# Altium schematic sheet 原理图文件.SchDoc
size A3; PageSetup: Record=PageOptions|CenterHorizontal=True|CenterVertical=True|PrintScale=0.89|XCorrection=1.00|YCorrection=1.00|PrintKind=1|BorderSize=5000000|LeftOffset=0|BottomOffset=0|Orientation=2|PaperLength=1000|PaperWidth=1000|Scale=100|PaperSource=15|PrintQuality=600|MediaType=1|DitherType=10|PaperKind=信纸¦PrintScaleMode=1
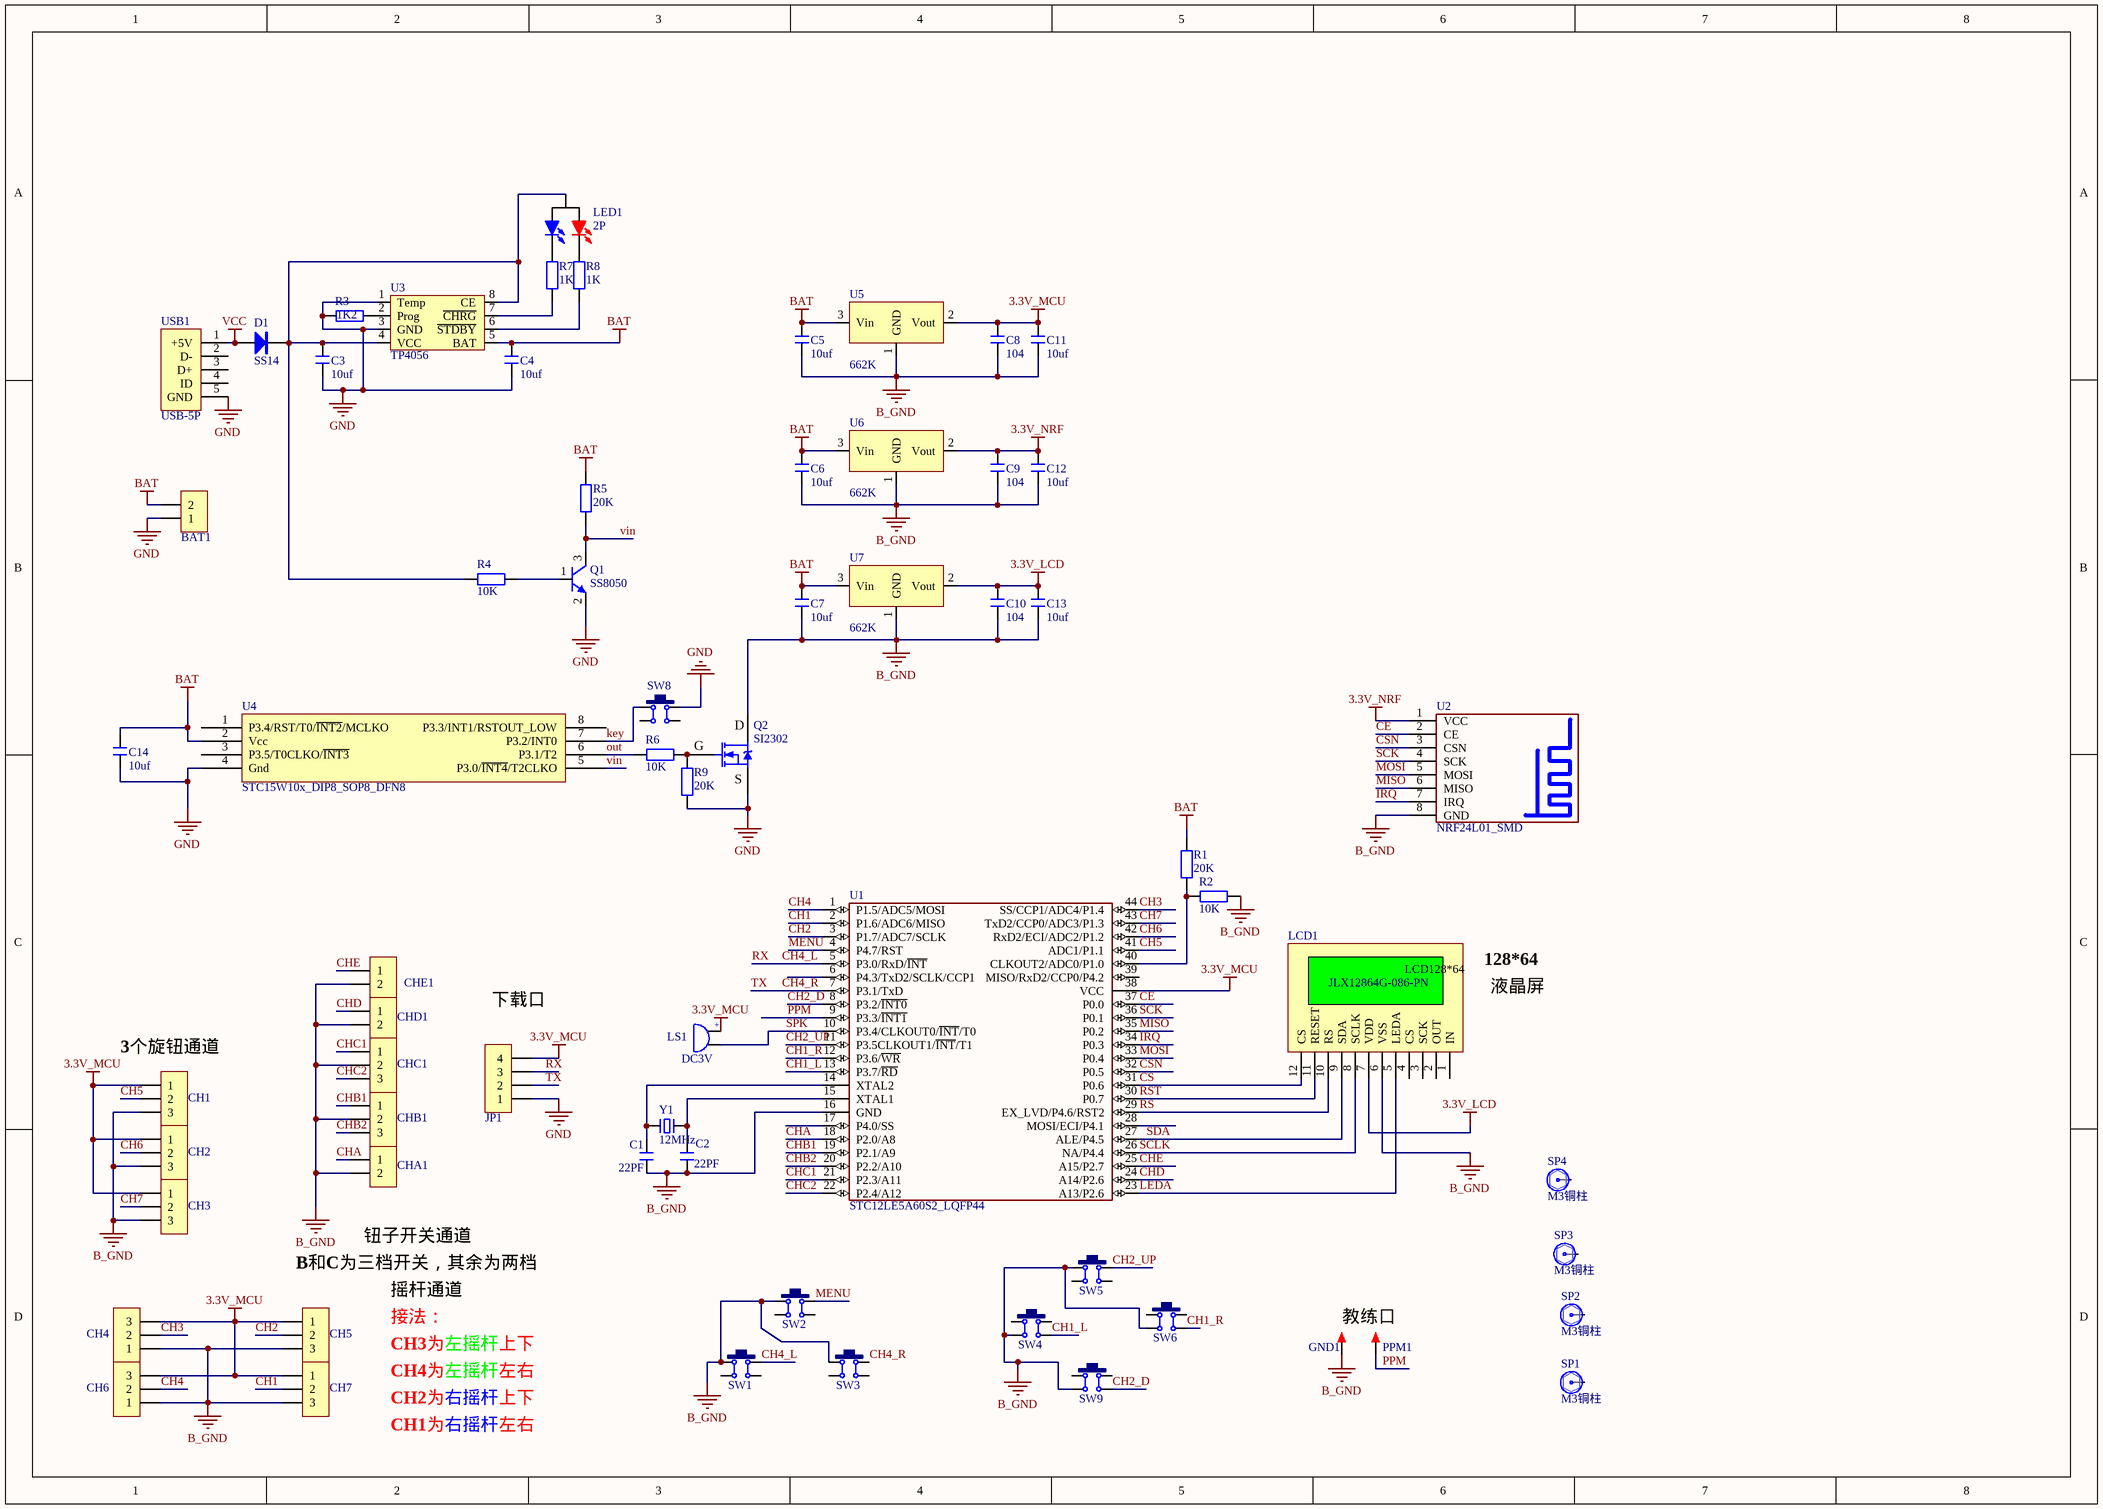
[diagram p0: 原理图文件.SchDoc]

## Parts
BAT1  HDR-1X2  [XH2.54-LI-2P]  (value not drawn)
C1  22PF  [C 0805_L]
C2  22PF  [C 0805_L]
C3  10uf  [C 0805_L]
C4  10uf  [C 0805_L]
C5  10uf  [C 0805_L]
C6  10uf  [C 0805_L]
C7  10uf  [C 0805_L]
C8  104  [C 0805_L]
C9  104  [C 0805_L]
C10  104  [C 0805_L]
C11  10uf  [C 0805_L]
C12  10uf  [C 0805_L]
C13  10uf  [C 0805_L]
C14  10uf  [C 0805_L]
CH1  CH5  [HDR2.54-LI-3P]  (value not drawn)
CH2  CH6  [HDR2.54-LI-3P]  (value not drawn)
CH3  CH7  [HDR2.54-LI-3P]  (value not drawn)
CH4  CH3  [HDR2.54-LI-3P]  (value not drawn)
CH5  CH2  [HDR2.54-LI-3P]  (value not drawn)
CH6  CH4  [HDR2.54-LI-3P]  (value not drawn)
CH7  CH1  [HDR2.54-LI-3P]  (value not drawn)
CHA1  CHA  [HDR2.54-LI-2P]  (value not drawn)
CHB1  CHB  [HDR2.54-LI-3P]  (value not drawn)
CHC1  CHC  [HDR2.54-LI-3P]  (value not drawn)
CHD1  CHD  [HDR2.54-LI-2P]  (value not drawn)
CHE1  CHE  [HDR2.54-LI-2P]  (value not drawn)
D1  SS14  [SMA]
GND1  TEST  [TEST 1.6]  (value not drawn)
JP1  HDR-1X4  [HDR2.54-LI-4P]  (value not drawn)
LCD1  JLX12864G-086-PN  [JLX12864G-086]
LED1  2P  [LED 3mm-2P]
LS1  DC3V  [BEEP 5x9x5.5]
PPM1  TEST  [TEST 1.6]  (value not drawn)
Q1  SS8050  [SOT23-3N]
Q2  SI2302  [SOT23-3N]
R1  20K  [R 0805_L]
R2  10K  [R 0805_L]
R3  1K2  [R 0805_L]
R4  10K  [R 0805_L]
R5  20K  [R 0805_L]
R6  10K  [R 0805_L]
R7  1K  [R 0805_L]
R8  1K  [R 0805_L]
R9  20K  [R 0805_L]
SP1  M3铜柱  [M3x7_L]
SP2  M3铜柱  [M3x7_L]
SP3  M3铜柱  [M3x7_L]
SP4  M3铜柱  [M3x7_L]
SW1  6x6x5  [TSW DIP-6*6*8]  (value not drawn)
SW2  6x6x5  [TSW DIP-6*6*8]  (value not drawn)
SW3  6x6x5  [TSW DIP-6*6*8]  (value not drawn)
SW4  6x6x5  [TSW DIP-6*6*8]  (value not drawn)
SW5  6x6x5  [TSW DIP-6*6*8]  (value not drawn)
SW6  6x6x5  [TSW DIP-6*6*8]  (value not drawn)
SW8  6x6x5  [TSW DIP-6*6*8]  (value not drawn)
SW9  6x6x5  [TSW DIP-6*6*8]  (value not drawn)
U1  STC12LE5A60S2_LQFP44  [LQFP44 10X10_N]
U2  NRF24L01_SMD  [NRF24l01_4to1]
U3  TP4056  [SOP8_N]
U4  STC15W10x_DIP8_SOP8_DFN8  [SOP8_N]
U5  662K  [SOT23-3L]
U6  662K  [SOT23-3L]
U7  662K  [SOT23-3L]
USB1  USB-5P  [USB-MICRO_D]
Y1  12MHz  [OSC HC-49S]

## Nets
3.3V_LCD: C10.2 C13.2 LCD1.7(VDD) U7.2(Vout)
3.3V_MCU: C8.2 C11.2 CH1.1 CH2.1 CH3.1 CH4.3 CH5.1 CH6.3 CH7.1 JP1.4 LS1.1 U1.38(VCC) U5.2(Vout)
3.3V_NRF: C9.2 C12.2 U2.1(VCC) U6.2(Vout)
B_GND: C1.1 C2.1 C5.1 C6.1 C7.1 C8.1 C9.1 C10.1 C11.1 C12.1 C13.1 CH1.3 CH2.3 CH3.3 CH4.1 CH5.3 CH6.1 CH7.3 CHA1.2 CHB1.2 CHC1.2 CHD1.2 CHE1.2 GND1.1 LCD1.6(VSS) Q2.3(D) R2.1 SW1.1 SW2.1 SW3.2 SW4.4 SW5.1 SW6.3 SW9.4 U1.16(GND) U2.8(GND) U5.1(GND) U6.1(GND) U7.1(GND)
BAT: BAT1.2 C4.2 C5.2 C6.2 C7.2 C14.2 R1.2 R5.2 U3.5(BAT) U4.2(Vcc) U5.3(Vin) U6.3(Vin) U7.3(Vin)
GND: BAT1.1 C3.1 C4.1 C14.1 JP1.1 Q1.2(E) Q2.2(S) R3.1 R9.1 SW8.1 U2.9 U2.10 U2.11 U3.1(Temp) U3.3(GND) U4.4(Gnd) USB1.5(GND)
VCC: D1.1(A) USB1.1(+5V)
CE: U1.37(P0.0) U2.2(CE)
CH1: CH7.2 U1.2(P1.6/ADC6/MISO)
CH1_L: SW4.3 U1.13(P3.7/~{RD})
CH1_R: SW6.4 U1.12(P3.6/~{WR})
CH2: CH5.2 U1.3(P1.7/ADC7/SCLK)
CH2_D: SW9.3 U1.8(P3.2/~{INT0})
CH2_UP: SW5.2 U1.11(P3.5CLKOUT1/~{INT}/T1)
CH3: CH4.2 U1.44(SS/CCP1/ADC4/P1.4)
CH4: CH6.2 U1.1(P1.5/ADC5/MOSI)
CH4_L: JP1.3 SW1.2 U1.5(P3.0/RxD/~{INT})  [also labelled RX]
CH4_R: JP1.2 SW3.1 U1.7(P3.1/TxD)  [also labelled TX]
CH5: CH1.2 U1.41(ADC1/P1.1)
CH6: CH2.2 U1.42(RxD2/ECI/ADC2/P1.2)
CH7: CH3.2 U1.43(TxD2/CCP0/ADC3/P1.3)
CHA: CHA1.1 U1.18(P2.0/A8)
CHB1: CHB1.1 U1.19(P2.1/A9)
CHB2: CHB1.3 U1.20(P2.2/A10)
CHC1: CHC1.1 U1.21(P2.3/A11)
CHC2: CHC1.3 U1.22(P2.4/A12)
CHD: CHD1.1 U1.24(A14/P2.6)
CHE: CHE1.1 U1.25(A15/P2.7)
CS: LCD1.12(CS) U1.31(P0.6)
CSN: U1.32(P0.5) U2.3(CSN)
IRQ: U1.34(P0.3) U2.7(IRQ)
key: SW8.2 U4.7(P3.2/INT0)
LEDA: LCD1.5(LEDA) U1.23(A13/P2.6)
MENU: SW2.2 U1.4(P4.7/RST)
MISO: U1.35(P0.2) U2.6(MISO)
MOSI: U1.33(P0.4) U2.5(MOSI)
out: R6.1 U4.6(P3.1/T2)
PPM: PPM1.1 U1.9(P3.3/~{INT1})
RS: LCD1.10(RS) U1.29(EX_LVD/P4.6/RST2)
RST: LCD1.11(RESET) U1.30(P0.7)
SCK: U1.36(P0.1) U2.4(SCK)
SCLK: LCD1.8(SCLK) U1.26(NA/P4.4)
SDA: LCD1.9(SDA) U1.27(ALE/P4.5)
SPK: LS1.2 U1.10(P3.4/CLKOUT0/~{INT}/T0)
vin: Q1.3(C) R5.1 U4.5(P3.0/~{INT4}/T2CLKO)
NetC1_2: C1.2 U1.14(XTAL2) Y1.1
NetC2_2: C2.2 U1.15(XTAL1) Y1.2
NetC3_2: C3.2 D1.2(K) LED1.1 R4.1 U3.4(VCC) U3.8(CE)
NetLED1_2: LED1.2 R8.2
NetLED1_3: LED1.3 R7.2
NetQ1_1: Q1.1(B) R4.2
NetQ2_1: Q2.1(G) R6.2 R9.2
NetR1_1: R1.1 R2.2 U1.40(CLKOUT2/ADC0/P1.0)
NetR3_2: R3.2 U3.2(Prog)
NetR7_1: R7.1 U3.7(~{CHRG})
NetR8_1: R8.1 U3.6(~{STDBY})

Not connected (* = marked no-connect by the designer): LCD1 1(IN) 2(OUT) 3(SCK) 4(CS); SP1 1; SP2 1; SP3 1; SP4 1; SW1 3 4; SW2 3 4; SW3 3 4; SW4 1 2; SW5 3 4; SW6 1 2; SW8 3 4; SW9 1 2; U1 6(P4.3/TxD2/SCLK/CCP1) 17(P4.0/SS) 28(MOSI/ECI/P4.1) 39(MISO/RxD2/CCP0/P4.2); U4 1(P3.4/RST/T0/~{INT2}/MCLKO) 3(P3.5/T0CLKO/~{INT3}) 8(P3.3/INT1/RSTOUT_LOW); USB1 2(D-) 3(D+) 4(ID)

## Notes on the sheet
- 128*64
- 液晶屏
- (near CH1) 3个旋钮通道
- (near JP1) 下载口
- 钮子开关通道
- (near CH5) B和C为三档开关，其余为两档
- 摇杆通道
- 接法：
- 教练口
- CH3为            上下
- CH4为            左右
- 左摇杆
- CH1为            左右
- CH2为            上下
- 右摇杆
- (in symbol BEEP) +
- (in symbol JLX12864G-086) LCD128*64

## Library data of the parts
BAT1 CHA1 CHD1 CHE1 = Header 2: 2P接插件; 版权归属: 源创客; BOM名称: 2P接插件; 学习资源: www.ooocke.com
C1-C14 = C: 无极性贴片电容; 版权归属: 源创客; BOM名称: 无极性贴片电容; 学习资源: www.ooocke.com
CH1-CH7 CHB1 CHC1 = Header 3: 3P接插件; 版权归属: 源创客; BOM名称: 3P接插件; 学习资源: www.ooocke.com
D1 = SS14: 肖特基二极管; 版权归属: 源创客; 属性: 40V/1A; BOM名称: 肖特基二极管; 学习资源: www.ooocke.com
GND1 PPM1 = TEST: 测试点; 版权归属: 源创客; BOM名称: 测试点; 学习资源: www.ooocke.com
JP1 = Header 4: 4P接插件; 版权归属: 源创客; BOM名称: 4P接插件; 学习资源: www.ooocke.com
LCD1 = JLX12864G-086: 12864 点阵屏; 版权归属: 源创客; BOM名称: 12864 点阵屏; 学习资源: www.ooocke.com
LED1 = LED RG-A: 共阳双色LED; 版权归属: 源创客; BOM名称: 共阳双色LED; 学习资源: www.ooocke.com
LS1 = BEEP: 蜂鸣器; 版权归属: 源创客; BOM名称: 蜂鸣器; 学习资源: www.ooocke.com
Q1 = 8050-SMD: 高频放大-NPN型; 版权归属: 源创客; 属性: 40V 1.5A 1W 100MHZ; BOM名称: 高频放大-NPN型; 学习资源: www.ooocke.com
Q2 = SI2302: N沟道场效应管; 版权归属: 源创客; BOM名称: N沟道场效应管; 学习资源: www.ooocke.com
R1-R9 = R: 贴片电阻; 版权归属: 源创客; BOM名称: 贴片电阻; 学习资源: www.ooocke.com
SP1-SP4 = 铜柱小焊盘: 铜柱; 版权归属: 源创客; BOM名称: 铜柱; 学习资源: www.ooocke.com
SW1-SW6 SW8 SW9 = TSW DIP-6x6: 直插6x6轻触开关; 版权归属: 源创客; BOM名称: 直插6x6轻触开关; 学习资源: www.ooocke.com
U1 = STC12C5A60S2
U3 = TP4056: 充电芯片
USB1 = USB-5P: 微型USB母座; 版权归属: 源创客; BOM名称: 微型USB母座; 学习资源: www.ooocke.com
Y1 = XTAL-2P: 2脚无源脚晶振; 版权归属: 源创客; BOM名称: 2脚无源脚晶振; 学习资源: www.ooocke.com